# EAGLE design team_flag (EAGLE 7.4.0)
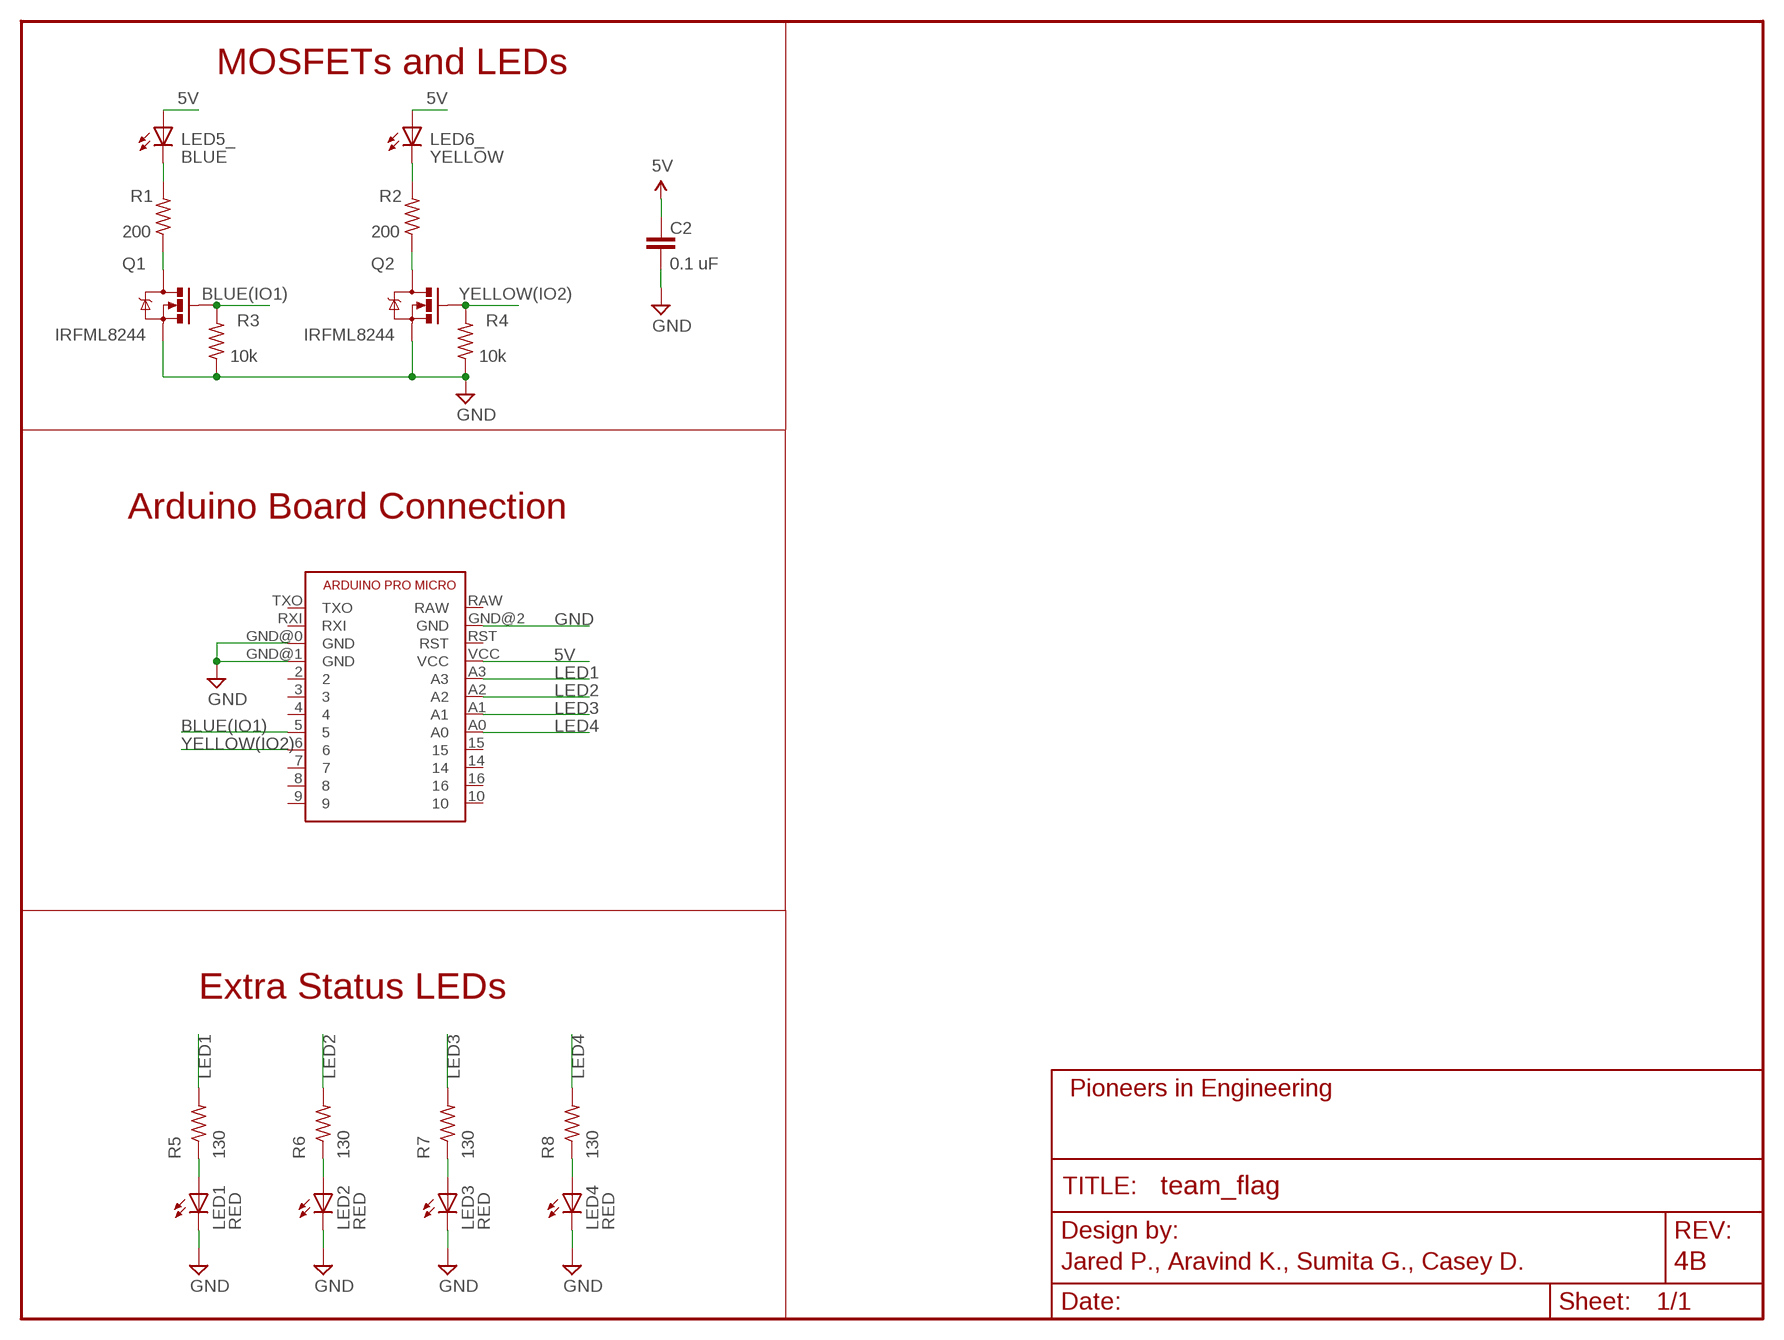
[diagram p0: schematic, sheet 1]
FRAME1 (FRAME-LETTER): AUTHOR: Jared P., Aravind K., Sumita G., Casey D.; REVISION: 4B

## Parts
C2  0.1 uF  CAP0603-CAP  [0603-CAP]
LED1  RED  LED0805  [LED-0805]
LED2  RED  LED0805  [LED-0805]
LED3  RED  LED0805  [LED-0805]
LED4  RED  LED0805  [LED-0805]
LED5_  BLUE  LEDLED5MM-NOFLAT  [LED5MM-NOFLAT]
LED6_  YELLOW  LEDLED5MM-NOFLAT  [LED5MM-NOFLAT]
Q1  IRFML8244  MOSFET-NCHANNELSMD  [SOT23-3]
Q2  IRFML8244  MOSFET-NCHANNELSMD  [SOT23-3]
R1  200  R-US_R0603  [R0603]
R2  200  R-US_R0603  [R0603]
R3  10k  R-US_R0603  [R0603]
R4  10k  R-US_R0603  [R0603]
R5  130  R-US_R0603  [R0603]
R6  130  R-US_R0603  [R0603]
R7  130  R-US_R0603  [R0603]
R8  130  R-US_R0603  [R0603]
U$3  ARDUINO_PRO_MICRO  [ARDUINO_PRO_MICRO]

## Nets
5V: C2.1 LED5_.A LED6_.A U$3.VCC
BLUE(IO1): Q1.1(G) R3.2 U$3.5
BSOURCE: Q1.3(D) R1.1
GND: C2.2 LED1.C LED2.C LED3.C LED4.C Q1.2(S) Q2.2(S) R3.1 R4.1 U$3.GND@0(GND) U$3.GND@1(GND) U$3.GND@2(GND)
LED1: R5.2 U$3.A3
LED1R: LED1.A R5.1
LED2: R6.2 U$3.A2
LED2R: LED2.A R6.1
LED3: R7.2 U$3.A1
LED3R: LED3.A R7.1
LED4: R8.2 U$3.A0
LED4R: LED4.A R8.1
N$2: LED5_.K(C) R1.2
N$3: LED6_.K(C) R2.2
YELLOW(IO2): Q2.1(G) R4.2 U$3.6
YSOURCE: Q2.3(D) R2.1
Unconnected: U$3.2 U$3.3 U$3.4 U$3.7 U$3.8 U$3.9 U$3.10 U$3.14 U$3.15 U$3.16 U$3.RAW U$3.RST U$3.RXI U$3.TXO

## Notes on the sheet
- MOSFETs and LEDs
- Arduino Board Connection
- Extra Status LEDs

## Library data of the parts
C2 = pie:CAP: Capacitor Standard 0603 ceramic capacitor, and 0.1" leaded capacitor.; PIE-INT-REF-NUM: CAPACITOR-GENERIC
LED1-LED4 LED5_ LED6_ = pie:LED: LEDs Standard schematic elements and footprints for 5mm, 3mm, 1206, and 0603 sized LEDs. 5mm - Spark Fun Electronics SKU : COM-00529 (and others); PIE-INT-REF-NUM: LED
Q1 Q2 = pie:MOSFET-NCHANNEL: N-Type MOSFET, SOT23-3 Package; PIE-INT-REF-NUM: NMOS
R1-R8 = pie:R-US_: RESISTOR, American symbol; PIE-INT-REF-NUM: RESISTOR-GENERIC
U$3 = pie:ARDUINO_PRO_MICRO: Arduino Pro Micro Electrical System Year 9's Smart Sensor Core Pin Outs <https://cdn.sparkfun.com/assets/9/c/3/c/4/523a1765757b7f5c6e8b4567.png> Buy Here <http://www.aliexpress.com/item/Mini-Leonardo-Pro-Micro-ATmega32U4-5V-16MHz-Module-For-Arduino-Best-Quality/32284746884.html?ws_ab_test=searchweb201556_8,searchweb201602_2_10057_10056_10065_10055_10054_10067_10069_10059_10058_10017_10070_10060_10061_10052_10062_10053_10050_10051,searchweb201603_1&btsid=45993952-29ca-4de4-a0fb-c7fb72b8e1a5>

## Board
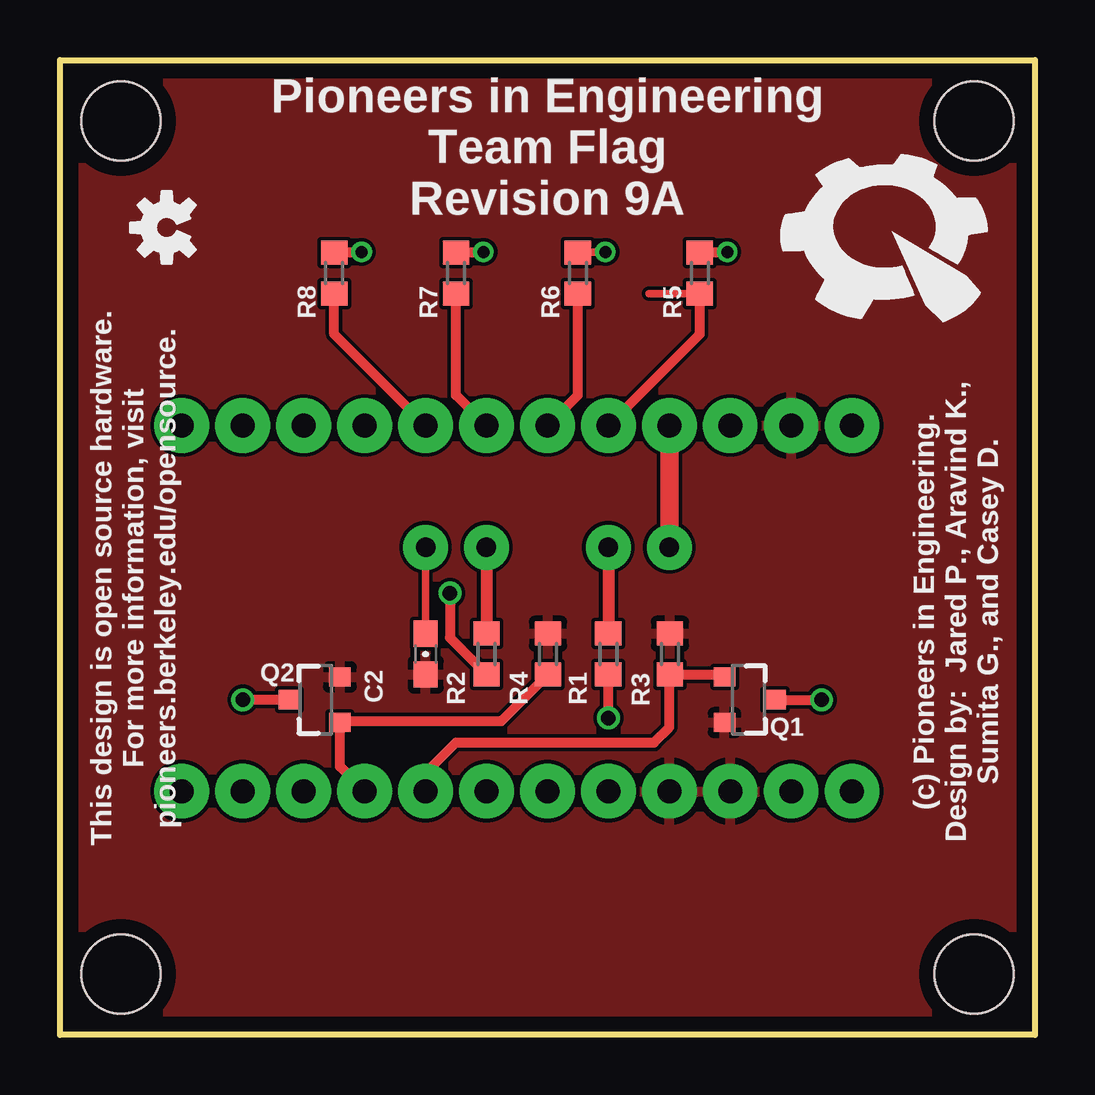
[diagram p1: board, top side]
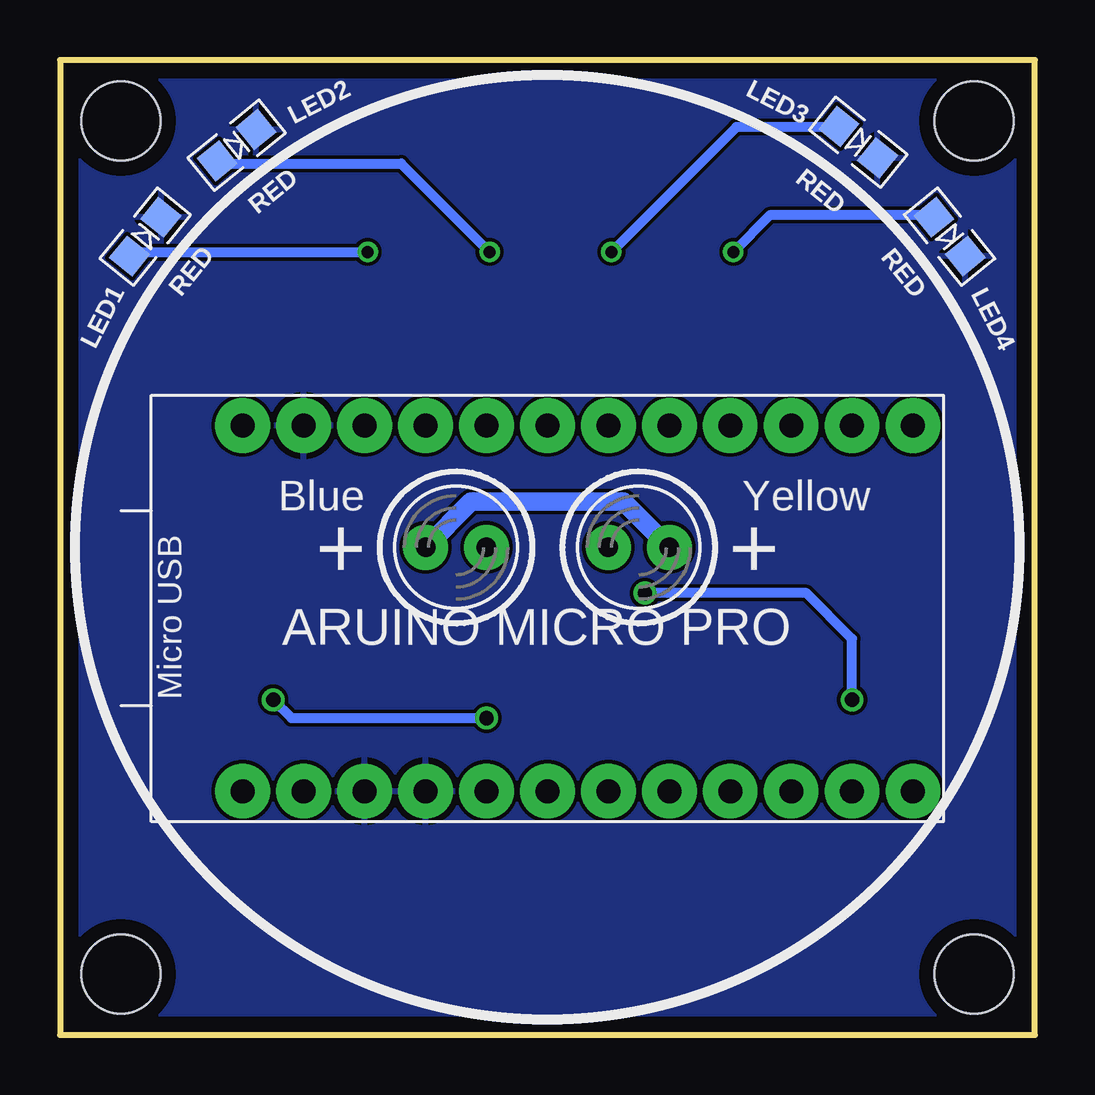
[diagram p2: board, bottom side, seen from below]

Size 40.64 x 40.64 mm. Coordinates in mm from the lower left corner, seen from the top.
Outline: 40.64,0 0,0 0,40.64 40.64,40.64 40.64,0
Copper layers (1*16): Top 2mil / dielectric 9mil / Bottom 2mil
Design rules "advancedcircuits-33each-pie": minimum track width 6mil, minimum drill 15mil, track to track 6mil, track to pad 6mil, pad to pad 6mil, via to via 6mil, smd to smd 6mil, copper to edge 25mil, drill to drill 7mil, minimum pad ring 7mil, minimum via ring 7mil, stop-mask expansion 3mil, vias tented up to drill 21mil, thermal gap 10mil

### Footprints (pad centres in the part's own frame; a part is rotated, then mirrored left to right if it is on the bottom)
0603-CAP = smd 1.1 x 1: 1 -0.85,0; 2 0.85,0
LED-0805 = smd 1.194 x 1.245: A -1.041,0; C 1.041,0
LED5MM-NOFLAT = drill 0.813 pad 1.88: A -1.27,0; K 1.27,0
SOT23-3 = smd 0.8 x 0.9: 1 -0.95,-1; 2 0.95,-1; 3 0,1.1
R0603 = smd 1 x 1.1: 1 -0.85,0; 2 0.85,0
ARDUINO_PRO_MICRO = drill 1 pad 2.286: 2 1.27,19.05; 3 1.27,16.51; 4 1.27,13.97; 5 1.27,11.43; 6 1.27,8.89; 7 1.27,6.35; 8 1.27,3.81; 9 1.27,1.27; 10 16.51,1.27; 14 16.51,6.35; 15 16.51,8.89; 16 16.51,3.81; A0 16.51,11.43; A1 16.51,13.97; A2 16.51,16.51; A3 16.51,19.05; GND@0 1.27,24.13; GND@1 1.27,21.59; GND@2 16.51,26.67; RAW 16.51,29.21; RST 16.51,24.13; RXI 1.27,26.67; TXO 1.27,29.21; VCC 16.51,21.59
STAND-OFF = hole 3.302: 0,0

### Placement (x,y rotation side)
C2  15.24,15.88 270 top
LED1  37.08,33.27 51 bottom
LED2  33.27,37.08 39 bottom
LED3  7.37,37.21 321 bottom
LED4  3.56,33.27 309 bottom
LED5_  24.13,20.32 0 bottom
LED6_  16.51,20.32 180 bottom
Q1  28.7,13.97 270 top
Q2  10.67,13.97 90 top
R1  22.86,15.88 90 top
R2  17.78,15.88 90 top
R3  25.43,15.88 270 top
R4  20.35,15.88 270 top
R5  26.67,31.75 270 top
R6  21.59,31.75 270 top
R7  16.51,31.75 270 top
R8  11.43,31.75 270 top
U$1  [PIE-LOGO-SMALL]  34.67,33.53 0 top
U$2  [OSHW-LOGO-S]  4.45,33.66 90 top
U$3  3.81,8.89 90 bottom
U$11  [STAND-OFF]  38.1,38.1 0 top
U$12  [STAND-OFF]  2.54,38.1 0 top
U$13  [STAND-OFF]  2.54,2.54 0 top
U$14  [STAND-OFF]  38.1,2.54 0 top

### Tracks (layer width: path | path; a pad name or v marks a point on that pad's centre or on a via)
5V
  Top 0.305: LED6_.A C2.1
  Top 0.762: LED5_.A U$3.VCC
  Bottom 0.762: LED5_.A 23.5,22.23 17.14,22.23 LED6_.A
BLUE(IO1)
  Top 0.406: U$3.5 15.24,10.92 16.51,12.19 24.77,12.19 25.4,12.83 25.4,15 R3.2 27.6,15.03 Q1.1
BSOURCE  (via drill 0.6)
  Top 0.406: Q1.3 v31.75,13.97 | v22.86,13.21 R1.1
  Bottom 0.406: v31.75,13.97 30.99,13.21 v22.86,13.21
GND
  pour Top: 0,40.64 40.64,40.64 40.64,0 0,0
  pour Bottom (rank 2): 40.64,0 0,0 0,40.64 40.64,40.64
LED1
  Top 0.305: R5.2 24.55,30.9
  Top 0.406: U$3.A3 26.67,29.21 R5.2
LED1R  (via drill 0.5)
  Top 0.305: R5.1 26.71,32.64
  Top 0.406: 26.71,32.64 v27.81,32.64
  Bottom 0.305: 37.56,32.64 LED1.A
  Bottom 0.406: 37.56,32.64 v27.81,32.64
LED2
  Top 0.406: U$3.A2 21.59,26.67 R6.2
LED2R  (via drill 0.5)
  Top 0.305: R6.1 21.63,32.64 v22.73,32.64
  Bottom 0.305: LED2.A 33.98,36.32
  Bottom 0.406: 33.98,36.32 26.42,36.32 v22.73,32.64
LED3
  Top 0.406: U$3.A1 16.51,26.67 R7.2
LED3R  (via drill 0.5)
  Top 0.305: R7.1 16.55,32.64
  Top 0.406: 16.55,32.64 v17.65,32.64
  Bottom 0.305: 8.2,37.85 LED3.A
  Bottom 0.406: 8.2,37.85 12.45,37.85 v17.65,32.64
LED4
  Top 0.406: U$3.A0 11.43,29.21 R8.2
LED4R  (via drill 0.5)
  Top 0.305: R8.1 11.47,32.64
  Top 0.406: 11.47,32.64 v12.57,32.64
  Bottom 0.305: 4.29,34.16 LED4.A
  Bottom 0.406: 4.29,34.16 11.05,34.16 v12.57,32.64
N$2
  Top 0.508: LED5_.K R1.2
N$3
  Top 0.508: LED6_.K R2.2
YELLOW(IO2)
  Top 0.406: U$3.6 11.67,11.19 Q2.1 11.73,13.08 18.4,13.08 R4.2
YSOURCE  (via drill 0.6)
  Top 0.406: Q2.3 v7.62,13.97 | v16.26,18.41 16.26,16.55 R2.1
  Bottom 0.406: v7.62,13.97 7.62,16.51 9.53,18.41 v16.26,18.41

### Text on the board
tPlace: Pioneers in Engineering / Team Flag / Revision 9A | This design is open source hardware. / For more information, visit / pioneers.berkeley.edu/opensource. | (c) Pioneers in Engineering. / Design by: Jared P., Aravind K., / Sumita G., and Casey D.
bPlace: Yellow | Blue